# EAGLE design miflo (EAGLE 8.6.0)
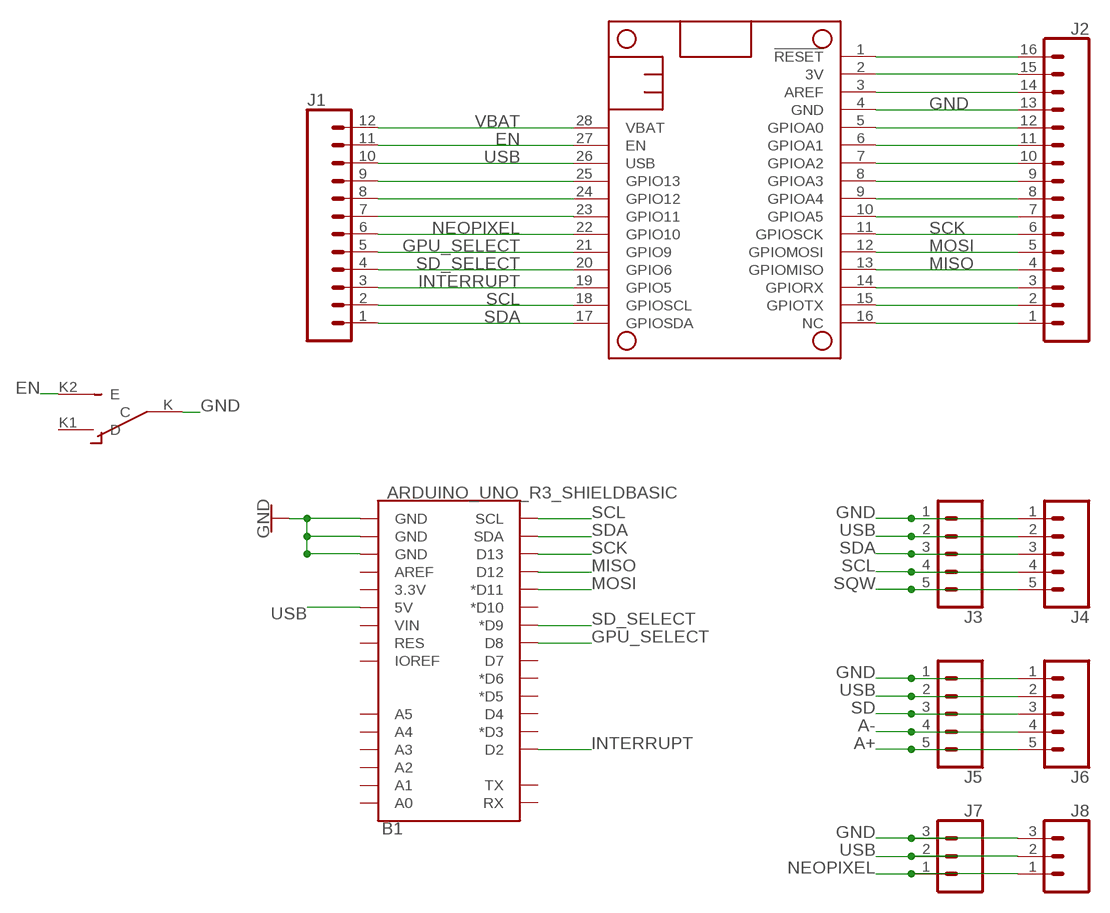
[diagram p0: schematic, sheet 1]

## Parts
B1  ARDUINO_UNO_R3_SHIELDBASIC  [UNO_R3_SHIELD]
J1  CONN_12  [1X12]
J2  CONN_16  [1X16]
J3  CONN_05  [1X05]
J4  CONN_05  [1X05]
J5  CONN_05  [1X05]
J6  CONN_05  [1X05]
J7  CONN_03  [1X03]
J8  CONN_03  [1X03]
MS2  FEATHERWING_NODIM  [FEATHERWING_DIM]
U$11  SLIDE-SWITCH  [SLIDE-SWITCH]

## Nets
3V: J2.15 MS2.2(3V)
A+: J5.5 J6.5
A-: J5.4 J6.4
EN: J1.11 MS2.27(EN) U$11.K2(E)
GND: B1.GND@0(GND) B1.GND@1(GND) B1.GND@2(GND) J2.13 J3.1 J4.1 J5.1 J6.1 J7.3 J8.3 MS2.4(GND) U$11.K(C)
GPU_SELECT: B1.D8 J1.5 MS2.21(GPIO9)
INTERRUPT: B1.D2 J1.3 MS2.19(GPIO5)
MISO: B1.D12 J2.4 MS2.13(GPIOMISO)
MOSI: B1.D11(*D11) J2.5 MS2.12(GPIOMOSI)
N$2: J1.9 MS2.25(GPIO13)
N$3: J1.8 MS2.24(GPIO12)
N$4: J1.7 MS2.23(GPIO11)
N$6: J2.1 MS2.16(NC)
N$7: J2.2 MS2.15(GPIOTX)
N$8: J2.3 MS2.14(GPIORX)
N$9: J2.7 MS2.10(GPIOA5)
N$10: J2.8 MS2.9(GPIOA4)
N$11: J2.9 MS2.8(GPIOA3)
N$12: J2.10 MS2.7(GPIOA2)
N$13: J2.11 MS2.6(GPIOA1)
N$14: J2.12 MS2.5(GPIOA0)
N$15: J2.14 MS2.3(AREF)
N$16: J2.16 MS2.1(!RESET)
NEOPIXEL: J1.6 J7.1 J8.1 MS2.22(GPIO10)
SCK: B1.D13 J2.6 MS2.11(GPIOSCK)
SCL: B1.SCL J1.2 J3.4 J4.4 MS2.18(GPIOSCL)
SD: J5.3 J6.3
SD_SELECT: B1.D9(*D9) J1.4 MS2.20(GPIO6)
SDA: B1.SDA J1.1 J3.3 J4.3 MS2.17(GPIOSDA)
SQW: J3.5 J4.5
USB: B1.5V J1.10 J3.2 J4.2 J5.2 J6.2 J7.2 J8.2 MS2.26(USB)
VBAT: J1.12 MS2.28(VBAT)
Unconnected: B1.3.3V B1.A0 B1.A1 B1.A2 B1.A3 B1.A4 B1.A5 B1.AREF B1.D3(*D3) B1.D4 B1.D5(*D5) B1.D6(*D6) B1.D7 B1.D10(*D10) B1.IOREF B1.RES B1.RX B1.TX B1.VIN U$11.K1(D)

## Library data of the parts
B1 = SparkFun-Boards:ARDUINO_UNO_R3_SHIELD: Arduino R3 Shield Footprint Shield form compatible with the Arduino Uno R3. SparkFun Products: MG2639 Cellular Shield <https://www.sparkfun.com/products/13120> MIDI Shield <https://www.sparkfun.com/products/12898> R3 Stackable Headers Kit <https://www.sparkfun.com/products/11417>
J1 = SparkFun-Connectors:CONN_12: Multi connection point. Often used as Generic Header-pin footprint for 0.1 inch spaced/style header connections On any of the 0.1 inch spaced packages, you can populate with these: Break Away Headers - Straight <https://www.sparkfun.com/products/116> (PRT-00116) Break Away Male Headers - Right Angle <https://www.sparkfun.com/products/553> (PRT-00553) Female Headers <https://www.sparkfun.com/products/115> (PRT-00115) Break Away Headers - Machine Pin <https://www.sparkfun.com/products/117> (PRT-00117) Break Away Female Headers - Swiss Machine Pin <https://www.sparkfun.com/products/743> (PRT-00743) For SCREWTERMINALS and SPRING TERMINALS visit here: Screw Terimnals on SparkFun.com <https://www.sparkfun.com/search/results?term=Screw+Terminals> (5mm/3.5mm/2.54mm spacing) This device is also useful as a general connection point to wire up your design to another part of your project. Our various solder wires solder well into these plated through hole pads. Hook-Up Wire - Assortment (Stranded, 22 AWG) <https://www.sparkfun.com/products/11375> (PRT-11375) Hook-Up Wire - Assortment (Solid Core, 22 AWG) <https://www.sparkfun.com/products/11367> (PRT-11367) View the entire wire category on our website here <https://www.sparkfun.com/categories/141> Special notes: Molex polarized connector foot print use with SKU : PRT-08231 with associated crimp pins and housings. 1MM SMD Version SKU: PRT-10208 NOTES ON THE VARIANTS LOCK and LOCK_LONGPADS... This footprint was designed to help hold the alignment of a through-hole component (i.e. 6-pin header) while soldering it into place. You may notice that each hole has been shifted either up or down by 0.005 of an inch from it's more standard position (which is a perfectly straight line). This slight alteration caused the pins (the squares in the middle) to touch the edges of the holes. Because they are alternating, it causes a "brace" to hold the component in place. 0.005 has proven to be the perfect amount of "off-center" position when using our standard breakaway headers. Although looks a little odd when you look at the bare footprint, once you have a header in there, the alteration is very hard to notice. Also,if you push a header all the way into place, it is covered up entirely on the bottom side.
J2 = SparkFun-Connectors:CONN_16: Multi connection point. Often used as Generic Header-pin footprint for 0.1 inch spaced/style header connections On any of the 0.1 inch spaced packages, you can populate with these: Break Away Headers - Straight <https://www.sparkfun.com/products/116> (PRT-00116) Break Away Male Headers - Right Angle <https://www.sparkfun.com/products/553> (PRT-00553) Female Headers <https://www.sparkfun.com/products/115> (PRT-00115) Break Away Headers - Machine Pin <https://www.sparkfun.com/products/117> (PRT-00117) Break Away Female Headers - Swiss Machine Pin <https://www.sparkfun.com/products/743> (PRT-00743) For SCREWTERMINALS and SPRING TERMINALS visit here: Screw Terimnals on SparkFun.com <https://www.sparkfun.com/search/results?term=Screw+Terminals> (5mm/3.5mm/2.54mm spacing) This device is also useful as a general connection point to wire up your design to another part of your project. Our various solder wires solder well into these plated through hole pads. Hook-Up Wire - Assortment (Stranded, 22 AWG) <https://www.sparkfun.com/products/11375> (PRT-11375) Hook-Up Wire - Assortment (Solid Core, 22 AWG) <https://www.sparkfun.com/products/11367> (PRT-11367) View the entire wire category on our website here <https://www.sparkfun.com/categories/141> Special notes: Molex polarized connector foot print use with SKU : PRT-08231 with associated crimp pins and housings. 1MM SMD Version SKU: PRT-10208 NOTES ON THE VARIANTS LOCK and LOCK_LONGPADS... This footprint was designed to help hold the alignment of a through-hole component (i.e. 6-pin header) while soldering it into place. You may notice that each hole has been shifted either up or down by 0.005 of an inch from it's more standard position (which is a perfectly straight line). This slight alteration caused the pins (the squares in the middle) to touch the edges of the holes. Because they are alternating, it causes a "brace" to hold the component in place. 0.005 has proven to be the perfect amount of "off-center" position when using our standard breakaway headers. Although looks a little odd when you look at the bare footprint, once you have a header in there, the alteration is very hard to notice. Also,if you push a header all the way into place, it is covered up entirely on the bottom side.
J3-J6 = SparkFun-Connectors:CONN_05: Multi connection point. Often used as Generic Header-pin footprint for 0.1 inch spaced/style header connections On any of the 0.1 inch spaced packages, you can populate with these: Break Away Headers - Straight <https://www.sparkfun.com/products/116> (PRT-00116) Break Away Male Headers - Right Angle <https://www.sparkfun.com/products/553> (PRT-00553) Female Headers <https://www.sparkfun.com/products/115> (PRT-00115) Break Away Headers - Machine Pin <https://www.sparkfun.com/products/117> (PRT-00117) Break Away Female Headers - Swiss Machine Pin <https://www.sparkfun.com/products/743> (PRT-00743) For SCREWTERMINALS and SPRING TERMINALS visit here: Screw Terimnals on SparkFun.com <https://www.sparkfun.com/search/results?term=Screw+Terminals> (5mm/3.5mm/2.54mm spacing) This device is also useful as a general connection point to wire up your design to another part of your project. Our various solder wires solder well into these plated through hole pads. Hook-Up Wire - Assortment (Stranded, 22 AWG) <https://www.sparkfun.com/products/11375> (PRT-11375) Hook-Up Wire - Assortment (Solid Core, 22 AWG) <https://www.sparkfun.com/products/11367> (PRT-11367) View the entire wire category on our website here <https://www.sparkfun.com/categories/141> Special notes: Molex polarized connector foot print use with SKU : PRT-08231 with associated crimp pins and housings. 1MM SMD Version SKU: PRT-10208
J7 J8 = SparkFun-Connectors:CONN_03: Multi connection point. Often used as Generic Header-pin footprint for 0.1 inch spaced/style header connections On any of the 0.1 inch spaced packages, you can populate with these: Break Away Headers - Straight <https://www.sparkfun.com/products/116> (PRT-00116) Break Away Male Headers - Right Angle <https://www.sparkfun.com/products/553> (PRT-00553) Female Headers <https://www.sparkfun.com/products/115> (PRT-00115) Break Away Headers - Machine Pin <https://www.sparkfun.com/products/117> (PRT-00117) Break Away Female Headers - Swiss Machine Pin <https://www.sparkfun.com/products/743> (PRT-00743) Stackable Header - 3 Pin (Female, 0.1") <https://www.sparkfun.com/products/13875> (PRT-13875) For SCREWTERMINALS and SPRING TERMINALS visit here: Screw Terimnals on SparkFun.com <https://www.sparkfun.com/search/results?term=Screw+Terminals> (5mm/3.5mm/2.54mm spacing) This device is also useful as a general connection point to wire up your design to another part of your project. Our various solder wires solder well into these plated through hole pads. Hook-Up Wire - Assortment (Stranded, 22 AWG) <https://www.sparkfun.com/products/11375> (PRT-11375) Hook-Up Wire - Assortment (Solid Core, 22 AWG) <https://www.sparkfun.com/products/11367> (PRT-11367) View the entire wire category on our website here <https://www.sparkfun.com/categories/141> Special notes: Molex polarized connector foot print use with SKU : PRT-08232 with associated crimp pins and housings.
MS2 = Anthony's components:FEATHERWING
U$11 = FriedCamp:SLIDE-SWITCH

## Board
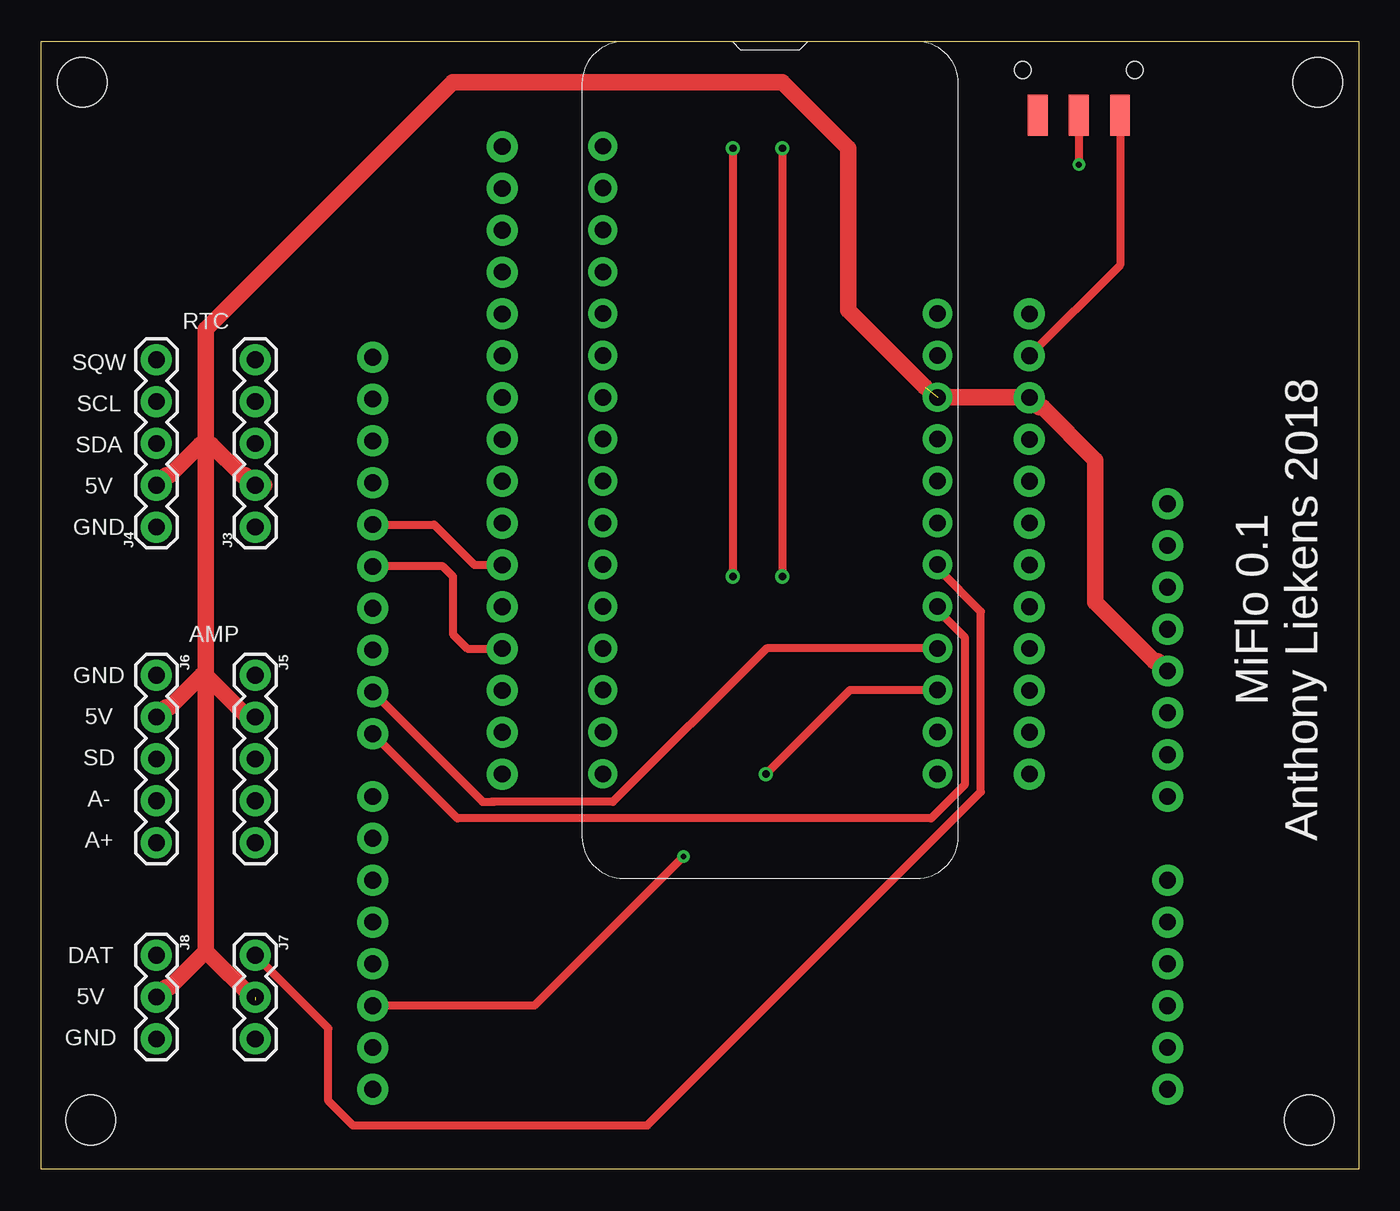
[diagram p1: board, top side]
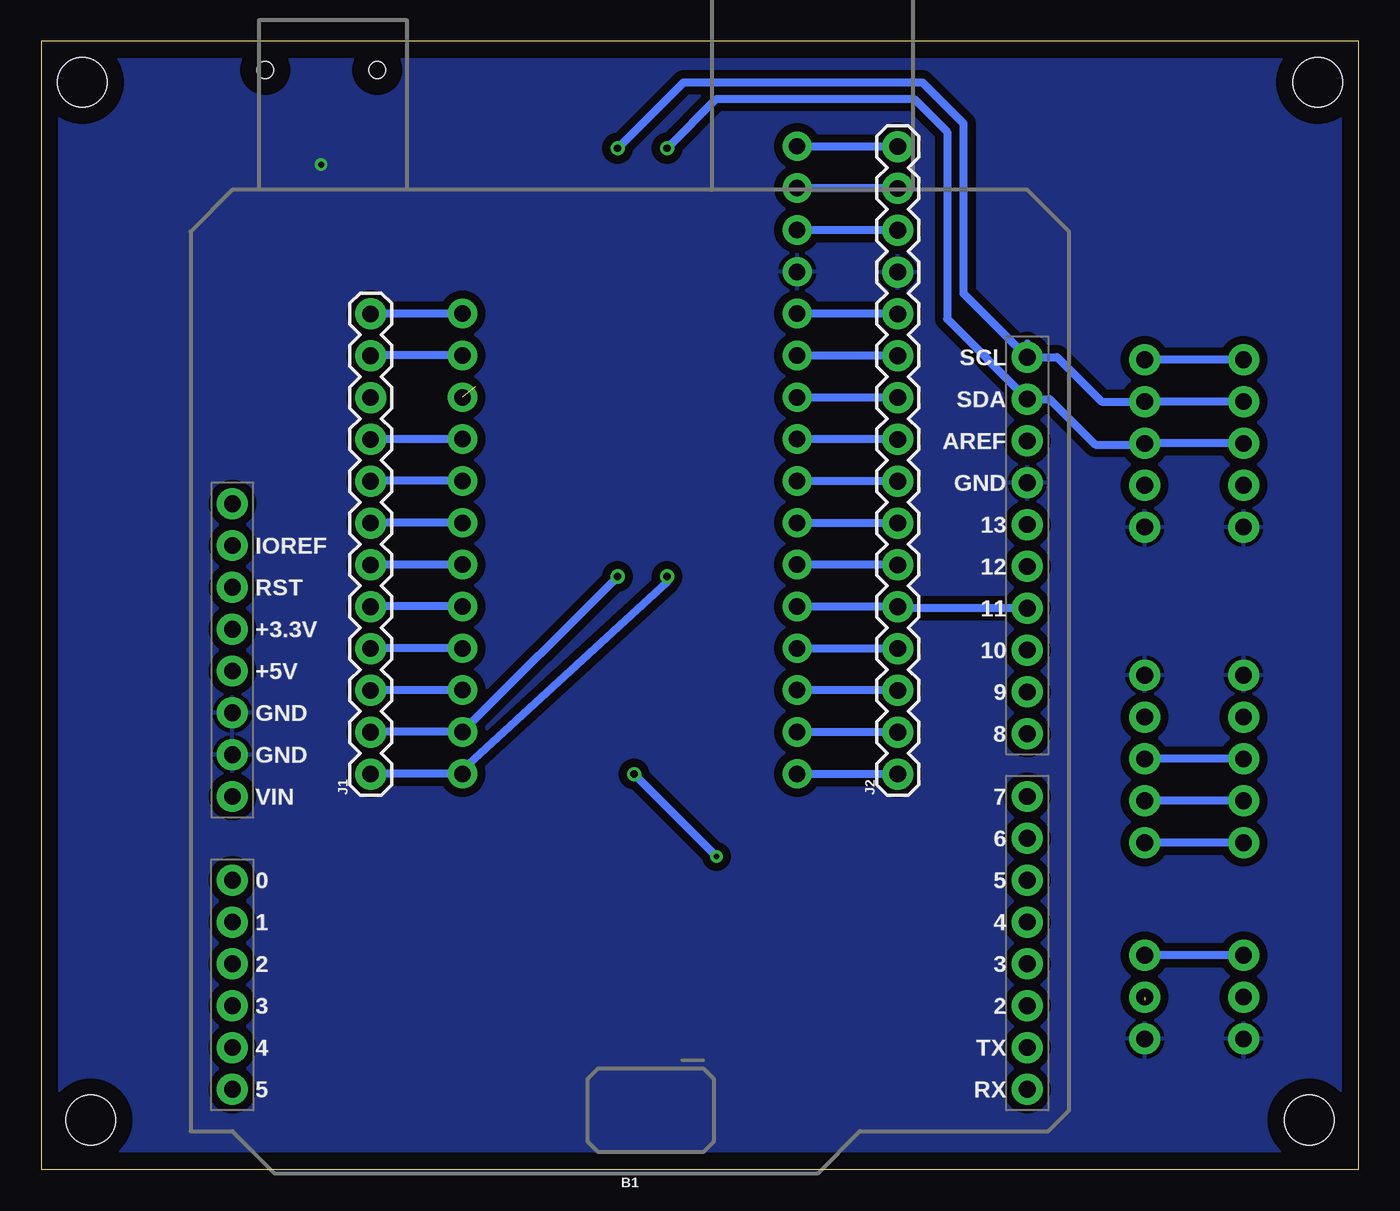
[diagram p2: board, bottom side, seen from below]

Size 80 x 68.5 mm. Coordinates in mm from the lower left corner, seen from the top.
Outline: 80,0 0,0 0,68.5 80,68.5 80,0
Copper layers (1*16): Top 0.035mm / dielectric 1.5mm / Bottom 0.035mm
Design rules "default *": minimum track width 0.5mm, minimum drill 0.45mm, track to track 0.5mm, track to pad 0.5mm, pad to pad 0.5mm, via to via 6mil, smd to smd 6mil, copper to edge 40mil, drill to drill 6mil, minimum pad ring 10mil, minimum via ring 8mil, stop-mask expansion 4mil, vias tented up to drill 0mil, thermal gap 10mil
Holes 3 mm at 2.5,66 3,3 77,3 77.5,66

### Footprints (pad centres in the part's own frame; a part is rotated, then mirrored left to right if it is on the bottom)
UNO_R3_SHIELD = drill 1.016 pad 1.88: 3.3V 24.13,-2.54; 5V 24.13,0; A0 24.13,12.7; A1 24.13,15.24; A2 24.13,17.78; A3 24.13,20.32; A4 24.13,22.86; A5 24.13,25.4; AREF -24.13,-13.97; D2 -24.13,20.32; D3 -24.13,17.78; D4 -24.13,15.24; D5 -24.13,12.7; D6 -24.13,10.16; D7 -24.13,7.62; D8 -24.13,3.81; D9 -24.13,1.27; D10 -24.13,-1.27; D11 -24.13,-3.81; D12 -24.13,-6.35; D13 -24.13,-8.89; GND@0 24.13,2.54; GND@1 24.13,5.08; GND@2 -24.13,-11.43; IOREF 24.13,-7.62; NC 24.13,-10.16; RES 24.13,-5.08; RX -24.13,25.4; SCL -24.13,-19.05; SDA -24.13,-16.51; TX -24.13,22.86; VIN 24.13,7.62
1X12 = drill 1.016 pad 1.88: 1 0,0; 2 2.54,0; 3 5.08,0; 4 7.62,0; 5 10.16,0; 6 12.7,0; 7 15.24,0; 8 17.78,0; 9 20.32,0; 10 22.86,0; 11 25.4,0; 12 27.94,0
1X16 = drill 1.016 pad 1.88: 1 0,0; 2 2.54,0; 3 5.08,0; 4 7.62,0; 5 10.16,0; 6 12.7,0; 7 15.24,0; 8 17.78,0; 9 20.32,0; 10 22.86,0; 11 25.4,0; 12 27.94,0; 13 30.48,0; 14 33.02,0; 15 35.56,0; 16 38.1,0
1X05 = drill 1.016 pad 1.88: 1 0,0; 2 2.54,0; 3 5.08,0; 4 7.62,0; 5 10.16,0
1X03 = drill 1.016 pad 1.88: 1 0,0; 2 2.54,0; 3 5.08,0
FEATHERWING_DIM = drill 1 pad 1.778: 1 6.35,1.27; 2 8.89,1.27; 3 11.43,1.27; 4 13.97,1.27; 5 16.51,1.27; 6 19.05,1.27; 7 21.59,1.27; 8 24.13,1.27; 9 26.67,1.27; 10 29.21,1.27; 11 31.75,1.27; 12 34.29,1.27; 13 36.83,1.27; 14 39.37,1.27; 15 41.91,1.27; 16 44.45,1.27; 17 44.45,21.59; 18 41.91,21.59; 19 39.37,21.59; 20 36.83,21.59; 21 34.29,21.59; 22 31.75,21.59; 23 29.21,21.59; 24 26.67,21.59; 25 24.13,21.59; 26 21.59,21.59; 27 19.05,21.59; 28 16.51,21.59
SLIDE-SWITCH = smd 1.2 x 2.5: K 0,0; K1 2.5,0; K2 -2.5,0 | hole 1: -3.4,-2.75; 3.4,-2.75

### Placement (x,y rotation side)
B1  44.26,30.26 180 bottom
J1  60,24 90 bottom
J2  28,24 90 bottom
J3  13,39 90 top
J4  7,39 90 top
J5  13,30 270 top
J6  7,30 270 top
J7  13,13 270 top
J8  7,13 270 top
MS2  32.83,68.47 270 top
U$11  63,64 180 top

### Tracks (layer width: path | path; a pad name or v marks a point on that pad's centre or on a via)
3V
  Bottom 0.5: J2.15 34.08,59.56 MS2.2
A+
  Bottom 0.5: J6.5 J5.5
A-
  Bottom 0.5: J6.4 J5.4
EN
  Top 0.5: J1.11 65.5,54.9 U$11.K2
  Bottom 0.5: MS2.27 59.98,49.42 J1.11
GND  (via drill 0.35)
  Top 0.5: U$11.K v63,61
  pour Bottom: -1,69.5 81,69.5 81,-1 -1,-1
GPU_SELECT
  Top 0.5: MS2.21 54.42,33.96 56.06,32.32 56.06,23.34 54.03,21.31 25.27,21.31 B1.D8
  Bottom 0.5: MS2.21 59.98,34.18 J1.5
INTERRUPT  (via drill 0.35, 0.45)
  Top 0.5: MS2.19 49.1,29.1 v44,24 | v39,19 29.94,9.94 B1.D2
  Bottom 0.5: MS2.19 59.98,29.1 J1.3 | v39,19 v44,24
MISO
  Top 0.5: B1.D12 24.39,36.61 25,36 25,32.5 25.88,31.62 J2.4
  Bottom 0.5: J2.4 34.08,31.62 MS2.13
MOSI
  Bottom 0.5: B1.D11 27.91,34.07 J2.5 34.08,34.16 MS2.12
N$2
  Bottom 0.5: MS2.25 59.98,44.34 J1.9
N$3
  Bottom 0.5: MS2.24 59.98,41.8 J1.8
N$4
  Bottom 0.5: MS2.23 59.98,39.26 J1.7
N$6
  Bottom 0.5: J2.1 34.08,24 MS2.16
N$7
  Bottom 0.5: J2.2 34.08,26.54 MS2.15
N$8
  Bottom 0.5: J2.3 34.08,29.08 MS2.14
N$9
  Bottom 0.5: J2.7 34.08,39.24 MS2.10
N$10
  Bottom 0.5: J2.8 34.08,41.78 MS2.9
N$11
  Bottom 0.5: J2.9 34.08,44.32 MS2.8
N$12
  Bottom 0.5: J2.10 34.08,46.86 MS2.7
N$13
  Bottom 0.5: J2.11 34.08,49.4 MS2.6
N$14
  Bottom 0.5: J2.12 34.08,51.94 MS2.5
N$15
  Bottom 0.5: J2.14 34.08,57.02 MS2.3
N$16
  Bottom 0.5: J2.16 34.08,62.1 MS2.1
NEOPIXEL
  Top 0.5: J7.1 17.44,8.56 17.44,4.16 18.93,2.67 36.8,2.67 57.06,22.93 57.06,33.86 54.42,36.5 MS2.22
  Bottom 0.5: J8.1 J7.1 | MS2.22 59.98,36.72 J1.6
SCK
  Top 0.5: B1.D13 23.85,39.15 26.3,36.7 J2.6
  Bottom 0.5: J2.6 34.08,36.7 MS2.11
SCL  (via drill 0.45)
  Top 0.5: v45,62 v45,36
  Bottom 0.5: J4.4 J3.4 15.62,46.62 18.31,49.31 B1.SCL | J1.2 59.98,26.56 MS2.18 45,35.98 v45,36 | v45,62 41,66 26.5,66 24,63.5 24,53.18 B1.SCL | 20.13,50.13 B1.SCL
SD
  Bottom 0.5: J6.3 J5.3
SD_SELECT
  Top 0.5: MS2.20 44.04,31.64 34.71,22.31 27.5,22.31 27.3,22.31 26.81,22.31 B1.D9
  Bottom 0.5: MS2.20 59.98,31.64 J1.4
SDA  (via drill 0.45)
  Top 0.5: v42,62 v42,36
  Bottom 0.5: J4.3 J3.3 13.08,44 16,44 18.77,46.77 B1.SDA 25,51.64 25,63 27,65 39,65 v42,62 | J1.1 59.98,24.02 MS2.17 54.42,24.24 42,35.66 v42,36
SQW
  Bottom 0.5: J4.5 J3.5
USB  (2 unrouted)
  Top 1: 53.64,47.53 49,52.17 49,62 45,66 25,66 10,51 10,44 | 13.54,41.54 J3.2 12.4,42.14 12.2,42.14 10.34,44 10,44 | J8.2 7.6,11.06 7.8,11.06 10,13.26 | 10,44 10,30 | 10,30 10,13.26 | 10,13.26 13,10.26 13,10 | J5.2 12.54,27.46 10,30 | J6.2 7.6,28.06 7.8,28.06 9.74,30 10,30 | J4.2 7.6,42.14 7.8,42.14 9.66,44 10,44 | MS2.26 59.98,46.88 J1.10 60.6,46.26 60.8,46.26 64,43.06 64,34.45 67.59,30.86 67.79,30.86 B1.5V
VBAT
  Bottom 0.5: MS2.28 59.98,51.96 J1.12

### Text on the board
tNames: RTC | SQW | SCL | SDA | 5V | GND | MiFlo 0.1 / Anthony Liekens 2018 | AMP | GND | 5V | SD | A- | A+ | DAT | 5V | GND